# EAGLE schematic TSOC_PSoC4L_R0_0 (EAGLE 6.6.0)
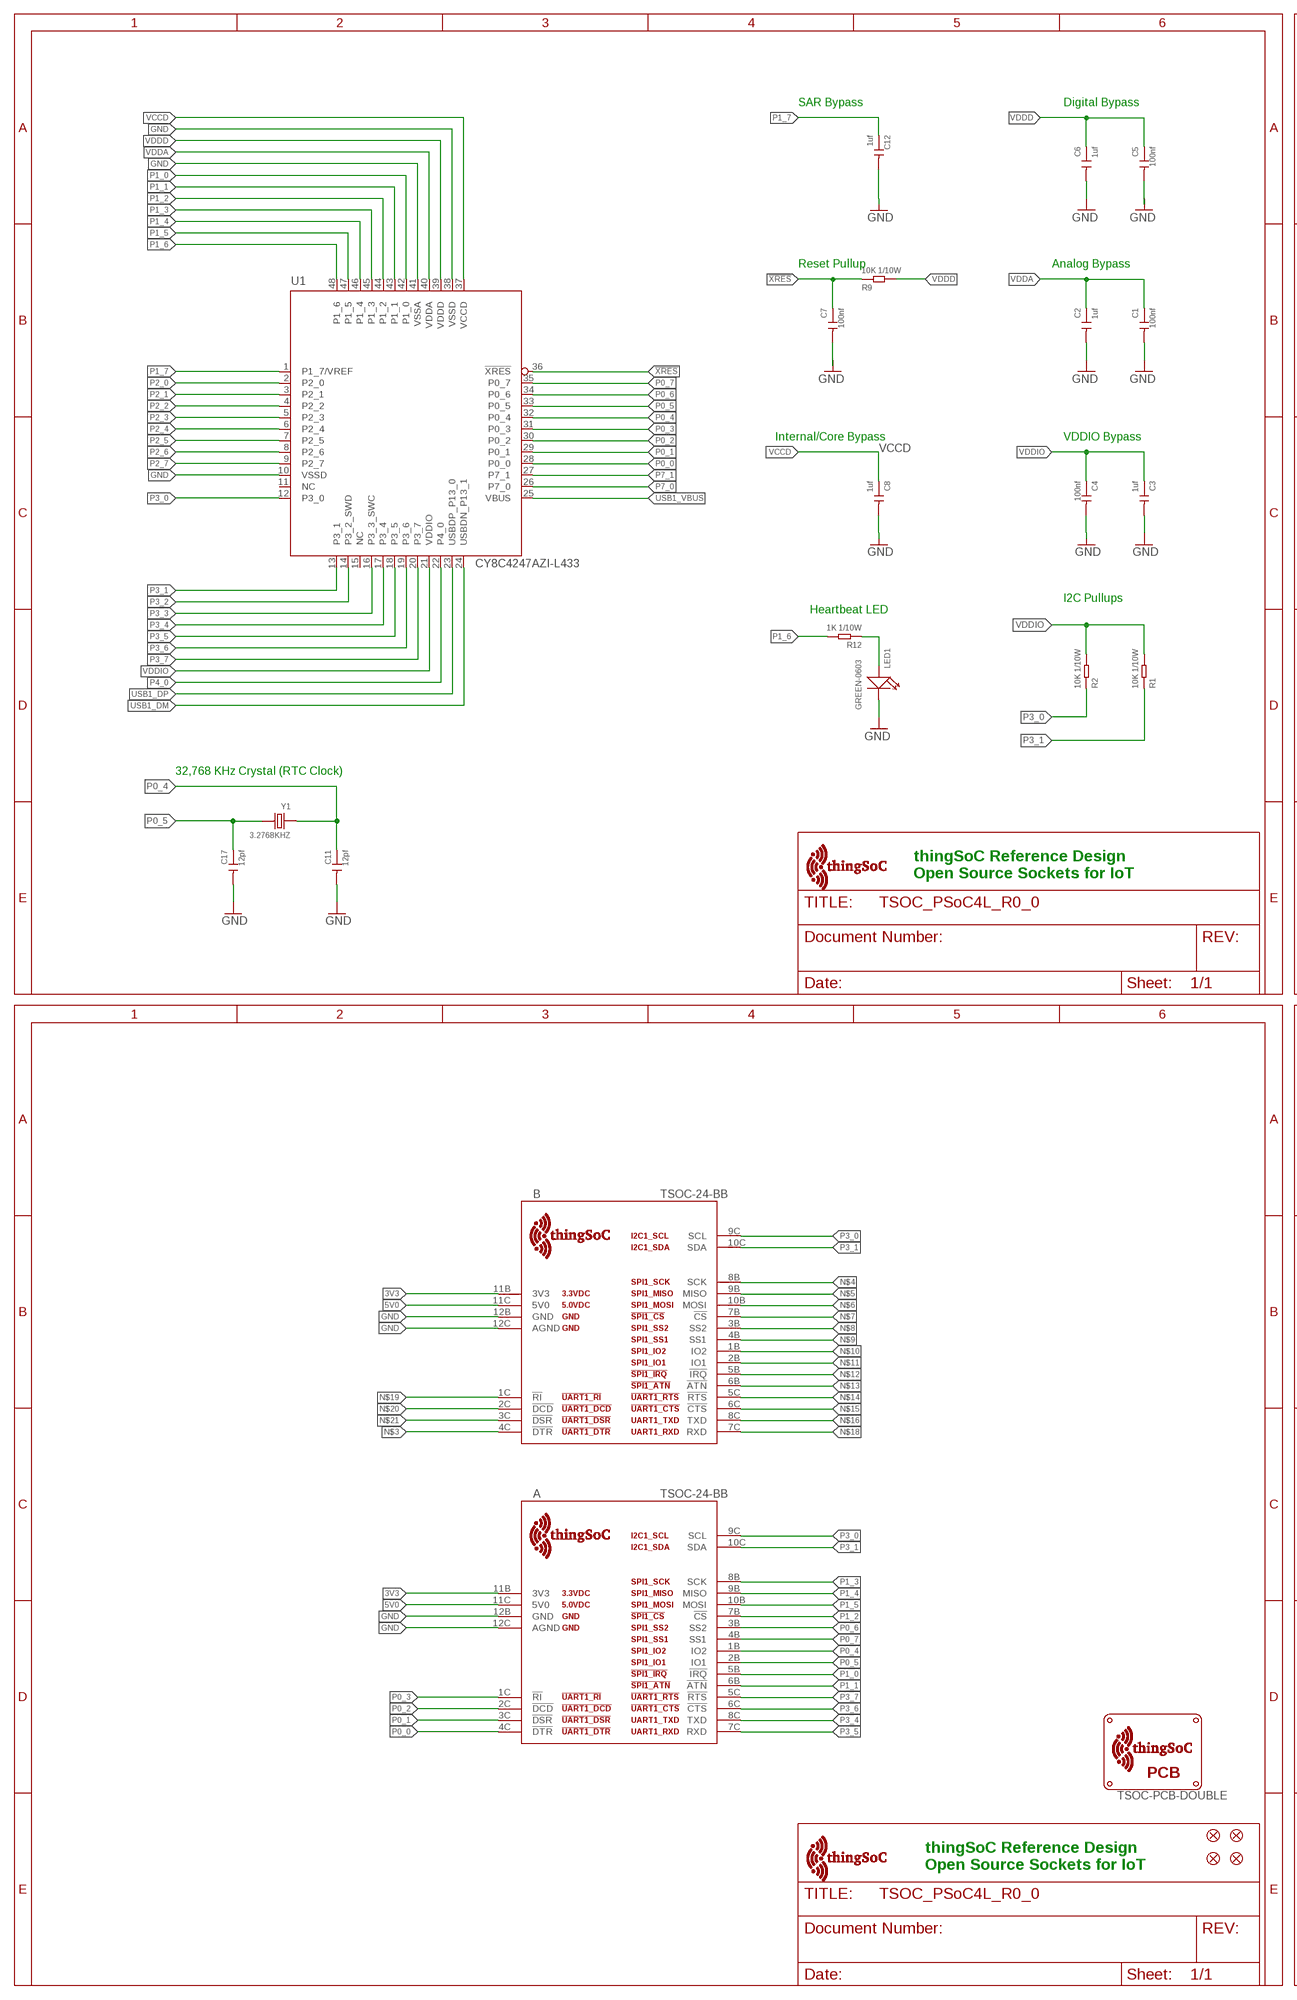
[diagram p0: schematic, sheet 1, part 1 of 2]
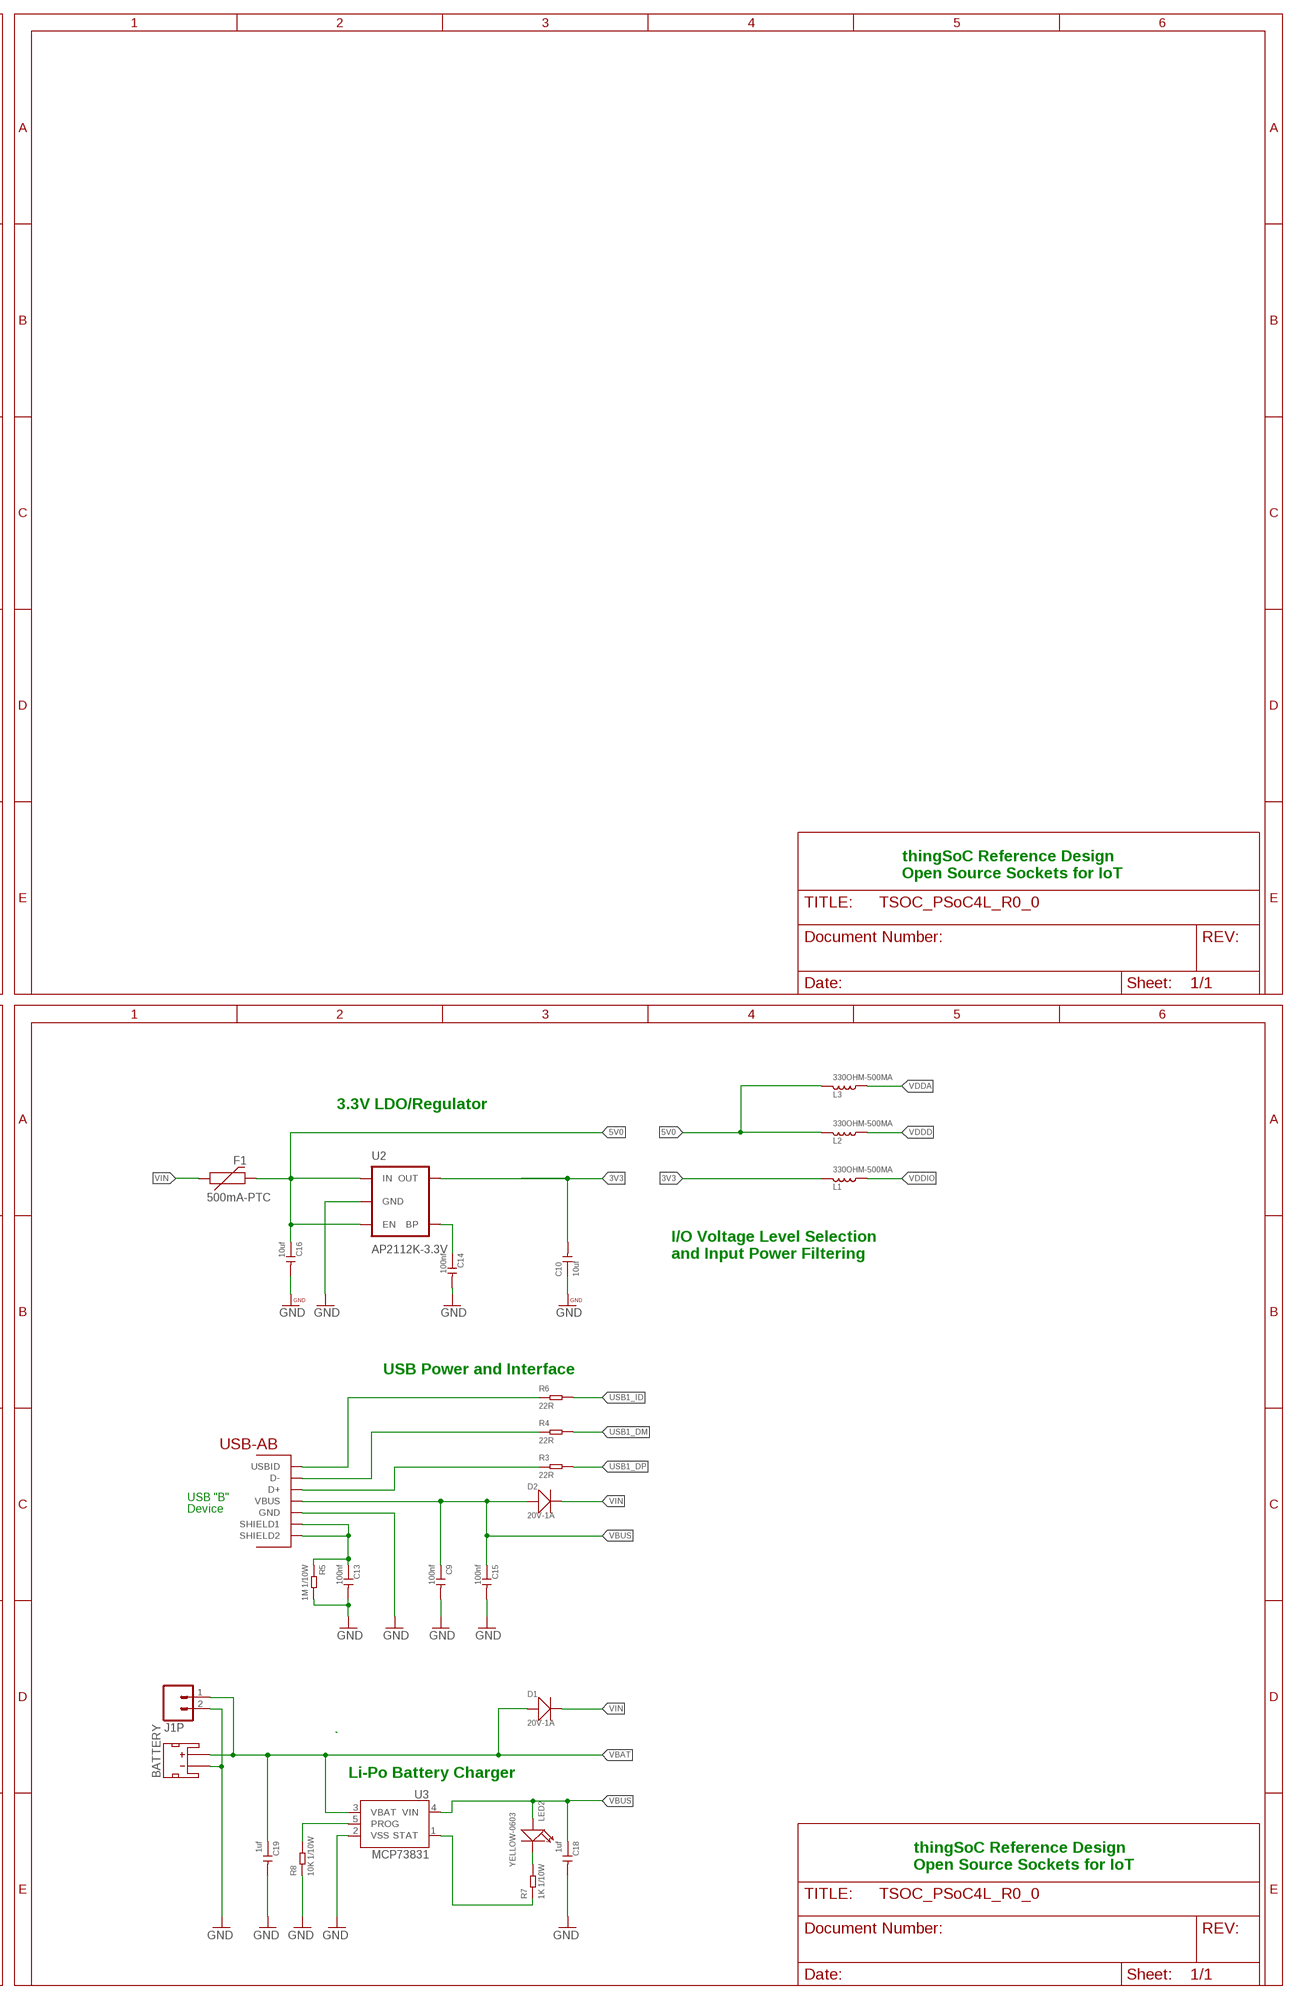
[diagram p1: schematic, sheet 1, part 2 of 2]

## Parts
A  TSOC-24-BB  [TSOC-BB-S24]
B  TSOC-24-BB  [TSOC-BB-S24]
BATTERY  JST_2MM_MALE  [JST-2-SMD]
C1  100nf  CERAMIC-100NF-50V-10%-X7R(0603)  [C0603]
C2  1uf  CERAMIC-1UF-25V-10%-X7R(0603)  [C0603]
C3  1uf  CERAMIC-1UF-25V-10%-X7R(0603)  [C0603]
C4  100nf  CERAMIC-100NF-50V-10%-X7R(0603)  [C0603]
C5  100nf  CERAMIC-100NF-50V-10%-X7R(0603)  [C0603]
C6  1uf  CERAMIC-1UF-25V-10%-X7R(0603)  [C0603]
C7  100nf  CERAMIC-100NF-50V-10%-X7R(0603)  [C0603]
C8  1uf  CERAMIC-1UF-25V-10%-X7R(0603)  [C0603]
C9  100nf  CERAMIC-100NF-50V-10%-X7R(0603)  [C0603]
C10  10uf  CERAMIC-10UF-10V-10%-X5R(0603)  [C0603]
C11  12pf  CERAMIC-12PF-50V-5%-NPO(0603)  [C0603]
C12  1uf  CERAMIC-1UF-25V-10%-X7R(0603)  [C0603]
C13  100nf  CERAMIC-100NF-50V-10%-X7R(0603)  [C0603]
C14  100nf  CERAMIC-100NF-50V-10%-X7R(0603)  [C0603]
C15  100nf  CERAMIC-100NF-50V-10%-X7R(0603)  [C0603]
C16  10uf  CERAMIC-10UF-10V-10%-X5R(0603)  [C0603]
C17  12pf  CERAMIC-12PF-50V-5%-NPO(0603)  [C0603]
C18  1uf  CERAMIC-1UF-25V-10%-X7R(0603)  [C0603]
C19  1uf  CERAMIC-1UF-25V-10%-X7R(0603)  [C0603]
D1  20V-1A  SMD-DIODE-SCHOTTKY-20V-1A(SOD-123)  [SOD-123]
D2  20V-1A  SMD-DIODE-SCHOTTKY-20V-1A(SOD-123)  [SOD-123]
F1  500mA-PTC  PTCSMD  [PTC-1206]
FID1  FIDUCIALUFIDUCIAL  [MICRO-FIDUCIAL]
FID2  FIDUCIALUFIDUCIAL  [MICRO-FIDUCIAL]
FID3  FIDUCIALUFIDUCIAL  [MICRO-FIDUCIAL]
FID4  FIDUCIALUFIDUCIAL  [MICRO-FIDUCIAL]
J1P  M02-JST-2-PTH-NO_SILK  [JST-2-PTH-NS]
L1  330OHM-500MA  SMD-FERRITE-CHIP-120-OHM-500MA(0603)  [L0603]
L2  330OHM-500MA  SMD-FERRITE-CHIP-120-OHM-500MA(0603)  [L0603]
L3  330OHM-500MA  SMD-FERRITE-CHIP-120-OHM-500MA(0603)  [L0603]
LED1  GREEN-0603  SMD-LED-CLEAR-GREEN(0603)  [LED-0603]
LED2  YELLOW-0603  SMD-LED-CLEAR-YELLOW(0603)  [LED-0603]
R1  10K 1/10W  SMD-RES-10K-5%-1/10W(0603)  [R0603]
R2  10K 1/10W  SMD-RES-10K-5%-1/10W(0603)  [R0603]
R3  22R  SMD-RES-22R-5%-1/10W(0603)  [R0603]
R4  22R  SMD-RES-22R-5%-1/10W(0603)  [R0603]
R5  1M 1/10W  SMD-RES-1M-5%-1/10W(0603)  [R0603]
R6  22R  SMD-RES-22R-5%-1/10W(0603)  [R0603]
R7  1K 1/10W  SMD-RES-1K-5%-1/10W(0603)  [R0603]
R8  10K 1/10W  SMD-RES-10K-5%-1/10W(0603)  [R0603]
R9  10K 1/10W  SMD-RES-10K-5%-1/10W(0603)  [R0603]
R12  1K 1/10W  SMD-RES-1K-5%-1/10W(0603)  [R0603]
U1  CY8C4247AZI-L433  [TQFP-7X7-48]
U2  AP2112K-3.3V  V_REG_LDOSMD  [SOT23-5]
U3  MCP73831  [SOT23-5]
U$1  TSOC-PCB-DOUBLE  [TS0C-BB-BRD-DBL-DIM]
U$100  TSOC-LOGO-SMALL  [TSOC-LOGO-SML]
U$101  TSOC-LOGO-LRG  [TSOC-LOGO-LRG]
USB  USB_AB  [USB-AB-MICRO-SMD]
Y1  3.2768KHZ  SMD-CRYSTAL-32.768KHZ-12.5PF-20PPM-90K(2P-L2.0X1.2MM)  [X2-SMD-L2.0X1.2X0.55MM]

## Nets
3V3: A.11B(3V3) B.11B(3V3) C10.2 L1.1 U2.5(OUT)
5V0: A.11C(5V0) B.11C(5V0) C16.1 F1.2 L2.1 L3.1 U2.1(IN) U2.3(EN)
!XRES: C7.1 R9.1 U1.36(!XRES)
BYPASS1: C14.1 U2.4(BP)
CLED: LED2.- R7.2
CSTAT: R7.1 U3.1(STAT)
GND: A.12B(GND) A.12C(AGND) B.12B(GND) B.12C(AGND) BATTERY.1(-) C1.2 C2.2 C3.2 C4.2 C5.2 C6.2 C7.2 C8.2 C9.2 C10.1 C11.2 C12.2 C13.2 C14.2 C15.2 C16.2 C17.2 C18.2 C19.2 J1P.2 LED1.- R5.2 R8.1 U1.10(VSSD) U1.38(VSSD) U1.41(VSSA) U2.2(GND) U3.2(VSS) USB.GND
N$1: R8.2 U3.5(PROG)
N$3: B.4C(!DTR)
N$4: B.8B(SCK)
N$5: B.9B(MISO)
N$6: B.10B(MOSI)
N$7: B.7B(!CS)
N$8: B.3B(SS2)
N$9: B.4B(SS1)
N$10: B.1B(IO2)
N$11: B.2B(IO1)
N$12: B.5B(!IRQ)
N$13: B.6B(!ATN)
N$14: B.5C(!RTS)
N$15: B.6C(!CTS)
N$16: B.8C(TXD)
N$17: LED1.+ R12.1
N$18: B.7C(RXD)
N$19: B.1C(!RI)
N$20: B.2C(!DCD)
N$21: B.3C(!DSR)
P0_0: A.4C(!DTR) U1.28(P0_0)
P0_1: A.3C(!DSR) U1.29(P0_1)
P0_2: A.2C(!DCD) U1.30(P0_2)
P0_3: A.1C(!RI) U1.31(P0_3)
P0_4: A.1B(IO2) C11.1 U1.32(P0_4) Y1.1
P0_5: A.2B(IO1) C17.1 U1.33(P0_5) Y1.2
P0_6: A.3B(SS2) U1.34(P0_6)
P0_7: A.4B(SS1) U1.35(P0_7)
P1_0: A.5B(!IRQ) U1.42(P1_0)
P1_1: A.6B(!ATN) U1.43(P1_1)
P1_2: A.7B(!CS) U1.44(P1_2)
P1_3: A.8B(SCK) U1.45(P1_3)
P1_4: A.9B(MISO) U1.46(P1_4)
P1_5: A.10B(MOSI) U1.47(P1_5)
P1_6: R12.2 U1.48(P1_6)
P1_7: C12.1 U1.1(P1_7/VREF)
P2_0: U1.2(P2_0)
P2_1: U1.3(P2_1)
P2_2: U1.4(P2_2)
P2_3: U1.5(P2_3)
P2_4: U1.6(P2_4)
P2_5: U1.7(P2_5)
P2_6: U1.8(P2_6)
P2_7: U1.9(P2_7)
P3_0: A.9C(SCL) B.9C(SCL) R2.1 U1.12(P3_0)
P3_1: A.10C(SDA) B.10C(SDA) R1.1 U1.13(P3_1)
P3_2: U1.14(P3_2_SWD)
P3_3: U1.16(P3_3_SWC)
P3_4: A.8C(TXD) U1.17(P3_4)
P3_5: A.7C(RXD) U1.18(P3_5)
P3_6: A.6C(!CTS) U1.19(P3_6)
P3_7: A.5C(!RTS) U1.20(P3_7)
P4_0: U1.22(P4_0)
P7_0: U1.26(P7_0)
P7_1: U1.27(P7_1)
USB1_DM: R4.2 U1.24(USBDN_P13_1)
USB1_DP: R3.2 U1.23(USBDP_P13_0)
USB1_I: R6.1 USB.ID(USBID)
USB1_ID: R6.2
USB1_M: R4.1 USB.D-
USB1_P: R3.1 USB.D+
USB1_SHIELD: C13.1 R5.1 USB.SHIELD1 USB.SHIELD2
USB1_VBUS: U1.25(VBUS)
VBAT: BATTERY.2(+) C19.1 D1.+ J1P.1 U3.3(VBAT)
VBUS: C9.1 C15.1 C18.1 D2.+ LED2.+ U3.4(VIN) USB.VBUS
VCCD: C8.1 U1.37(VCCD)
VDDA: C1.1 C2.1 L3.2 U1.40(VDDA)
VDDD: C5.1 C6.1 L2.2 R9.2 U1.39(VDDD)
VDDIO: C3.1 C4.1 L1.2 R1.2 R2.2 U1.21(VDDIO)
VIN: D1.- D2.- F1.1
Unconnected: BATTERY.NC1(PAD1) BATTERY.NC2(PAD2) U1.11(NC) U1.15(NC)

## Notes on the sheet
- SAR Bypass | Digital Bypass
- Reset Pullup | Analog Bypass
- Internal/Core Bypass | VDDIO Bypass
- I2C Pullups
- Heartbeat LED
- 32,768 KHz Crystal (RTC Clock)
- thingSoC Reference Design
  Open Source Sockets for IoT
- thingSoC Reference Design
  Open Source Sockets for IoT
- 3.3V LDO/Regulator
- I/O Voltage Level Selection
  and Input Power Filtering
- USB Power and Interface
- USB "B"
- Device
- Li-Po Battery Charger
- thingSoC Reference Design
  Open Source Sockets for IoT
- thingSoC Reference Design
  Open Source Sockets for IoT

## Library data of the parts
A B = thingSoC:TSOC-24: thingSoC Twenty-Four(24) Pin Socket Source LBR : http://www.thingsoc.com Github : https://github.com/thingsoc License : http://creativecommons.org/licenses/by-sa/4.0/ (Creative Commons 4.0) THIS SOFTWARE IS PROVIDED BY THE CONTRIBUTORS "AS IS" AND WITHOUT ANY EXPRESS OR IMPLIED WARRANTIES, INCLUDING, BUT NOT LIMITED TO, THE IMPLIED WARRANTIES OF MERCHANTABILITY AND FITNESS FOR A PARTICULAR PURPOSE ARE DISCLAIMED. IN NO EVENT SHALL THE COPYRIGHT OWNER OR CONTRIBUTORS BE LIABLE FOR ANY DIRECT, INDIRECT, INCIDENTAL, SPECIAL, EXEMPLARY, OR CONSEQUENTIAL DAMAGES (INCLUDING, BUT NOT LIMITED TO, PROCUREMENT OF SUBSTITUTE GOODS OR SERVICES; LOSS OF USE, DATA, OR PROFITS; OR BUSINESS INTERRUPTION) HOWEVER CAUSED AND ON ANY THEORY OF LIABILITY, WHETHER IN CONTRACT, STRICT LIABILITY, OR TORT (INCLUDING NEGLIGENCE OR OTHERWISE) ARISING IN ANY WAY OUT OF THE USE OF THIS SOFTWARE, EVEN IF ADVISED OF THE POSSIBILITY OF SUCH DAMAGE.
BATTERY = TSOC-ESP8266-BASE:JST_2MM_MALE: Mates to single-cell LiPo batteries. CONN-11443 Now with smashable polarity marks!; BTM_NEG: -; BTM_POS: +; PROD_ID: CONN-11443; TOP_NEG: -; TOP_POS: +
C1 C4 C5 C7 C9 C13-C15 = Seeed-Capacitor-2016:CERAMIC-100NF-50V-10%-X7R(0603): 302010138; MPN: CC0603KRX7R9BB104
C2 C3 C6 C8 C12 C18 C19 = Seeed-Capacitor-2016:CERAMIC-1UF-25V-10%-X7R(0603): 302010139; MPN: CC0603KRX7R8BB105
C10 C16 = Seeed-Capacitor-2016:CERAMIC-10UF-10V-10%-X5R(0603): 302010103; MPN: CC0603KRX5R6BB106
C11 C17 = Seeed-Capacitor-2016:CERAMIC-12PF-50V-5%-NPO(0603): 302010067; MPN: CC0603JRNPO9BN120
D1 D2 = Seeed-Diode-2016:SMD-DIODE-SCHOTTKY-20V-1A(SOD-123): 304020034; MPN: B5819W
F1 = SparkFun:PTC: Resettable Fuse PTC Resettable Fuse. Spark Fun Electronics SKU : COM-08357
FID1-FID4 = TSOC-ESP8266-BASE:FIDUCIAL: Fiducial Alignment Points Various fiducial points for machine vision alignment.
J1P = TSOC-ESP8266-BASE:M02: Standard 2-pin 0.1" header. Use with - straight break away headers ( PRT-00116) - right angle break away headers (PRT-00553) - swiss pins (PRT-00743) - machine pins (PRT-00117) - female headers (PRT-00115) Molex polarized connector foot print use with: PRT-08233 with associated crimp pins and housings. 2.54_SCREWTERM for use with PRT-10571. 3.5mm Screw Terminal footprints for PRT-08084 5mm Screw Terminal footprints for use with PRT-08432
L1-L3 = Seeed-Inductor-2016:SMD-FERRITE-CHIP-120-OHM-500MA(0603): 303030001; MPN: BLM18AG121SN1D; VALUE: 120OHM-500MA
LED1 = Seeed-LED-2016:SMD-LED-CLEAR-GREEN(0603): 304090043; MPN: 19-217-G7C-AN1P2-3T
LED2 = Seeed-LED-2016:SMD-LED-CLEAR-YELLOW(0603): 304090044; MPN: 19-217-Y5C-AM1N1VY-3T
R1 R2 R8 R9 = Seeed-Resistor-2016:SMD-RES-10K-5%-1/10W(0603): 301010293; MPN: RC0603JR-0710KL
R3 R4 R6 = Seeed-Resistor-2016:SMD-RES-22R-5%-1/10W(0603): 301010289; MPN: RC0603JR-0722RL
R5 = Seeed-Resistor-2016:SMD-RES-1M-5%-1/10W(0603): 301010100; MPN: RC0603JR-071ML
R7 R12 = Seeed-Resistor-2016:SMD-RES-1K-5%-1/10W(0603): 301010291; MPN: RC0603JR-071KL
U1 = PatternAgents-Cypress:CY8C4247AZI-L433: Cypress PSoC® 4 - Programmable System on Chip, Cortex-M0 Based : USB Version! http://www.cypress.com/?mpn=CY8C4247AZI-L433 LBR Source: http://www.patternagents.com THIS SOFTWARE IS PROVIDED BY THE CONTRIBUTORS "AS IS" AND WITHOUT ANY EXPRESS OR IMPLIED WARRANTIES, INCLUDING, BUT NOT LIMITED TO, THE IMPLIED WARRANTIES OF MERCHANTABILITY AND FITNESS FOR A PARTICULAR PURPOSE ARE DISCLAIMED. IN NO EVENT SHALL THE COPYRIGHT OWNER OR CONTRIBUTORS BE LIABLE FOR ANY DIRECT, INDIRECT, INCIDENTAL, SPECIAL, EXEMPLARY, OR CONSEQUENTIAL DAMAGES (INCLUDING, BUT NOT LIMITED TO, PROCUREMENT OF SUBSTITUTE GOODS OR SERVICES; LOSS OF USE, DATA, OR PROFITS; OR BUSINESS INTERRUPTION) HOWEVER CAUSED AND ON ANY THEORY OF LIABILITY, WHETHER IN CONTRACT, STRICT LIABILITY, OR TORT (INCLUDING NEGLIGENCE OR OTHERWISE) ARISING IN ANY WAY OUT OF THE USE OF THIS SOFTWARE, EVEN IF ADVISED OF THE POSSIBILITY OF SUCH DAMAGE.
U2 = SparkFun-PowerIC:V_REG_LDO: Voltage Regulator LDO Standard 150mA LDO voltage regulator in SOT-23 layout. Micrel part MIC5205. BP (by-pass) pin is used to lower output noise with 470pF cap.; PROD_ID: VREG-12457
U3 = TSOC-ESP8266-BASE:MCP73831: Miniature single cell, fully integrated Li-Ion, Li-polymer charge management controller http://ww1.microchip.com/downloads/en/DeviceDoc/20001984g.pdf IC-09995; PROD_ID: IC-09995
U$1 = thingSoC:TSOC-PCB: thingSoC PCB Outlines Boards Outlines for Standard Sizes (in the DImension Layer) (Registration marks in the tDocu layer - make sure to turn on tDocu/bDocu) Source LBR : http://www.thingsoc.com Github : https://github.com/thingsoc License : http://creativecommons.org/licenses/by-sa/4.0/ (Creative Commons 4.0) THIS SOFTWARE IS PROVIDED BY THE CONTRIBUTORS "AS IS" AND WITHOUT ANY EXPRESS OR IMPLIED WARRANTIES, INCLUDING, BUT NOT LIMITED TO, THE IMPLIED WARRANTIES OF MERCHANTABILITY AND FITNESS FOR A PARTICULAR PURPOSE ARE DISCLAIMED. IN NO EVENT SHALL THE COPYRIGHT OWNER OR CONTRIBUTORS BE LIABLE FOR ANY DIRECT, INDIRECT, INCIDENTAL, SPECIAL, EXEMPLARY, OR CONSEQUENTIAL DAMAGES (INCLUDING, BUT NOT LIMITED TO, PROCUREMENT OF SUBSTITUTE GOODS OR SERVICES; LOSS OF USE, DATA, OR PROFITS; OR BUSINESS INTERRUPTION) HOWEVER CAUSED AND ON ANY THEORY OF LIABILITY, WHETHER IN CONTRACT, STRICT LIABILITY, OR TORT (INCLUDING NEGLIGENCE OR OTHERWISE) ARISING IN ANY WAY OUT OF THE USE OF THIS SOFTWARE, EVEN IF ADVISED OF THE POSSIBILITY OF SUCH DAMAGE.
U$100 U$101 = thingSoC:TSOC-LOGO: thingSoC Logo Source LBR : http://www.thingsoc.com Github : https://github.com/thingsoc License : http://creativecommons.org/licenses/by-sa/4.0/ (Creative Commons 4.0) THIS SOFTWARE IS PROVIDED BY THE CONTRIBUTORS "AS IS" AND WITHOUT ANY EXPRESS OR IMPLIED WARRANTIES, INCLUDING, BUT NOT LIMITED TO, THE IMPLIED WARRANTIES OF MERCHANTABILITY AND FITNESS FOR A PARTICULAR PURPOSE ARE DISCLAIMED. IN NO EVENT SHALL THE COPYRIGHT OWNER OR CONTRIBUTORS BE LIABLE FOR ANY DIRECT, INDIRECT, INCIDENTAL, SPECIAL, EXEMPLARY, OR CONSEQUENTIAL DAMAGES (INCLUDING, BUT NOT LIMITED TO, PROCUREMENT OF SUBSTITUTE GOODS OR SERVICES; LOSS OF USE, DATA, OR PROFITS; OR BUSINESS INTERRUPTION) HOWEVER CAUSED AND ON ANY THEORY OF LIABILITY, WHETHER IN CONTRACT, STRICT LIABILITY, OR TORT (INCLUDING NEGLIGENCE OR OTHERWISE) ARISING IN ANY WAY OUT OF THE USE OF THIS SOFTWARE, EVEN IF ADVISED OF THE POSSIBILITY OF SUCH DAMAGE.
USB = BeeSafe:USB_AB: This is a USB AB connector that is compatible with USB OTG. i.e. this connector can serve as a host or device
Y1 = Seeed-Crystal Oscillator-2016:SMD-CRYSTAL-32.768KHZ-12.5PF-20PPM-90K(2P-L2.0X1.2MM): 306010020; MPN: FC-12M

## Net classes
1 vcc: width 0.254 mm